# Altium schematic sheet Pwr.SchDoc
size A4
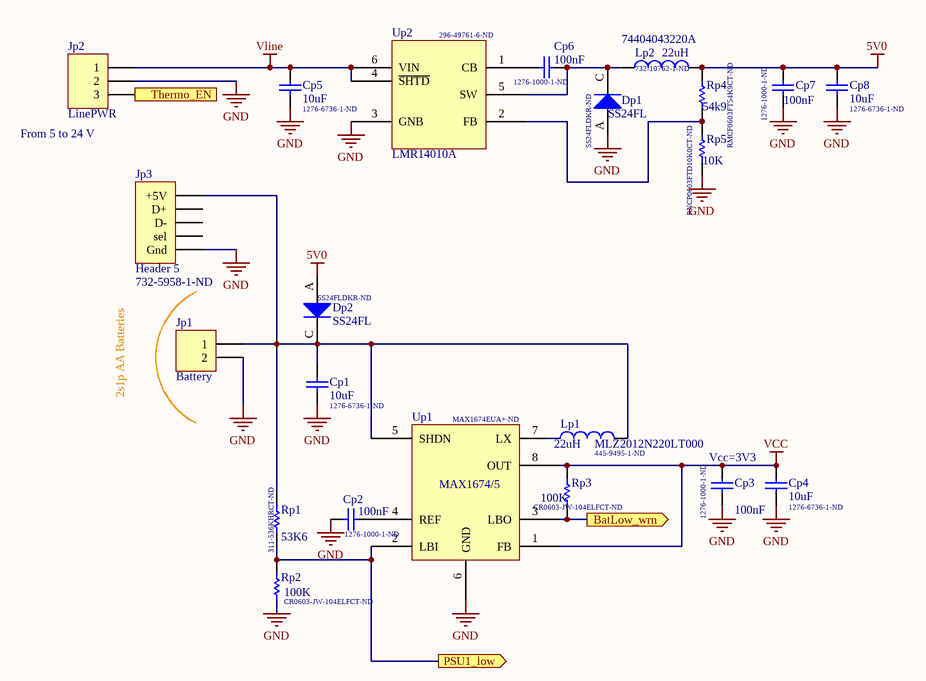
[diagram p0: Pwr.SchDoc]

## Parts
Cp1  value 10uF  Supplier Part Number 1: 1276-6736-1-ND  [C1206]  (hidden comment: Cap)
Cp2  value 100nF  Supplier Part Number 1: 1276-1000-1-ND  [c0603]  (hidden comment: Cap)
Cp3  value 100nF  Supplier Part Number 1: 1276-1000-1-ND  [c0603]  (hidden comment: Cap)
Cp4  value 10uF  Supplier Part Number 1: 1276-6736-1-ND  [C1206]  (hidden comment: Cap)
Cp5  value 10uF  Supplier Part Number 1: 1276-6736-1-ND  [C1206]  (hidden comment: Cap)
Cp6  value 100nF  Supplier Part Number 1: 1276-1000-1-ND  [c0603]  (hidden comment: Cap)
Cp7  value 100nF  Supplier Part Number 1: 1276-1000-1-ND  [c0603]  (hidden comment: Cap)
Cp8  value 10uF  Supplier Part Number 1: 1276-6736-1-ND  [C1206]  (hidden comment: Cap)
Dp1  SS24FL  Supplier Part Number 1: SS24FLDKR-ND  [SOD123F]
Dp2  SS24FL  Supplier Part Number 1: SS24FLDKR-ND  [SOD123F]
Jp1  Battery  [HDR1X2]
Jp2  LinePWR  [HDR1X3]
Jp3  Header 5  Supplier Part Number 1: 732-5958-1-ND  [614105150721]
Lp1  MLZ2012N220LT000  value 22uH  Supplier Part Number 1: 445-9495-1-ND  [6-0805_L]
Lp2  74404043220A  value 22uH  Supplier Part Number 1: 732-10762-1-ND  [WE_ind_4x4]
Rp1  value 53K6  Supplier Part Number 1: 311-536KHRCT-ND  [r0603]  (hidden comment: Res1)
Rp2  value 100K  Supplier Part Number 1: CR0603-JW-104ELFCT-ND  [r0603]  (hidden comment: Res1)
Rp3  value 100K  Supplier Part Number 1: CR0603-JW-104ELFCT-ND  [r0603]  (hidden comment: Res1)
Rp4  value 54k9  Supplier Part Number 1: RMCF0603FT54K9CT-ND  [r0603]  (hidden comment: Res1)
Rp5  value 10K  Supplier Part Number 1: RNCP0603FTD10K0CT-ND  [r0603]  (hidden comment: Res1)
Up1  Supplier Part Number 1: MAX1674EUA+-ND  [MSOP-8_TermalPad]  (hidden comment: MAX1674/5)
Up2  LMR14010A  Supplier Part Number 1: 296-49761-6-ND  [SOT23-6]

## Ports
BatLow_wrn (out), PSU1_low (out), Thermo_EN

## Nets
5V0: Cp7.1 Cp8.2 Dp2.A Lp2.2 Rp4.2
GND: Cp1.1 Cp2.2 Cp3.2 Cp4.1 Cp5.1 Cp7.2 Cp8.1 Dp1.A Jp1.2 Jp2.2 Jp3.1(Gnd) Rp2.1 Rp5.1 Up1.6(GND) Up2.3(GNB)
VCC: Cp3.1 Cp4.2 Rp3.2 Up1.1(FB) Up1.8(OUT)
Vline: Cp5.2 Jp2.1 Up2.4(~{SHTD}) Up2.6(VIN)
BatLow_wrn: Rp3.1 Up1.3(LBO) ; port BatLow_wrn
PSU1_low: Rp1.1 Rp2.2 Up1.2(LBI) ; port PSU1_low
Thermo_EN: Jp2.3 ; port Thermo_EN
NetCp1_2: Cp1.2 Dp2.C(K) Jp1.1 Jp3.5(+5V) Lp1.2 Rp1.2 Up1.5(SHDN)
NetCp2_1: Cp2.1 Up1.4(REF)
NetCp6_1: Cp6.1 Up2.1(CB)
NetCp6_2: Cp6.2 Dp1.C(K) Lp2.1 Up2.5(SW)
NetLp1_1: Lp1.1 Up1.7(LX)
NetRp4_1: Rp4.1 Rp5.2 Up2.2(FB)

Not connected (* = marked no-connect by the designer): Jp3 2(sel) 3(D-) 4(D+)

## Notes on the sheet
- (near Jp2) From 5 to 24 V
- 2s1p AA Batteries
- (near Cp3) Vcc=3V3

## Library data of the parts
Cp1-Cp8 = Cap: Capacitor; Published: 8-Jun-2000; LatestRevisionDate: 17-Jul-2002; LatestRevisionNote: Re-released for DXP Platform.; PackageReference: RAD-0.3; Publisher: Altium Limited; PackageDescription: Radial Cap, Thru-Hole; 2 Leads; 0.3 in Pin Spacing; Supplier 1: Digi-Key
Dp1 Dp2 = Diode: Default Diode; Published: 8-Jun-2000; LatestRevisionDate: 17-Jul-2002; LatestRevisionNote: Re-released for DXP Platform.; PackageVersion: Sep-1996; PackageReference: SMC; Publisher: Altium Limited; PackageDescription: DO-214-AB/SMC; 2 C-Bend Leads; Body 7.9 x 5.9 mm, inc. leads (LxW); Code_JEDEC: DO-214-AB; Supplier 1: Digi-Key
Jp1 = Header 2: Header, 2-Pin; LatestRevisionDate: 17-Jul-2002; LatestRevisionNote: Re-released for DXP Platform.; Publisher: Altium Limited
Jp2 = Header 3: Header, 3-Pin; LatestRevisionDate: 17-Jul-2002; LatestRevisionNote: Re-released for DXP Platform.; Publisher: Altium Limited
Jp3 = Header 5: Header, 5-Pin; LatestRevisionDate: 17-Jul-2002; LatestRevisionNote: Re-released for DXP Platform.; Publisher: Altium Limited; Supplier 1: Digi-Key
Lp1 Lp2 = Inductor: Code_IEC: 1005; Published: 8-Jun-2000; LatestRevisionDate: 29-May-2009; LatestRevisionNote: IPC-7351 Footprint Added.; PackageReference: 0402-A; Publisher: Altium Limited; PackageDescription: Chip Inductor; Code_JEITA: 0402; Supplier 1: Digi-Key
Rp1-Rp5 = Res1: Resistor; Published: 8-Jun-2000; LatestRevisionDate: 17-Jul-2002; LatestRevisionNote: Re-released for DXP Platform.; PackageReference: AXIAL-0.3; Publisher: Altium Limited; PackageDescription: Axial Device, Thru-Hole; 2 Leads; 0.3 in Pin Spacing; Supplier 1: Digi-Key
Up1 = MAX1674/5: High-Efficiency, Low-Supply-Current, / Compact, Step-Up DC-DC Converters; ComponentLink1Description: Datasheet; ComponentLink1URL: https://datasheets.maximintegrated.com/en/ds/MAX1674-MAX1676.pdf; Supplier 1: Digi-Key
Up2 = LMR14010A: LMR14010A 4-V to 40-V, 1-A Step-Down Converter With High Efficiency Eco-mode; ComponentLink1Description: Datasheet; ComponentLink1URL: http://www.ti.com/lit/ds/symlink/lmr14010a.pdf; Supplier 1: Digi-Key